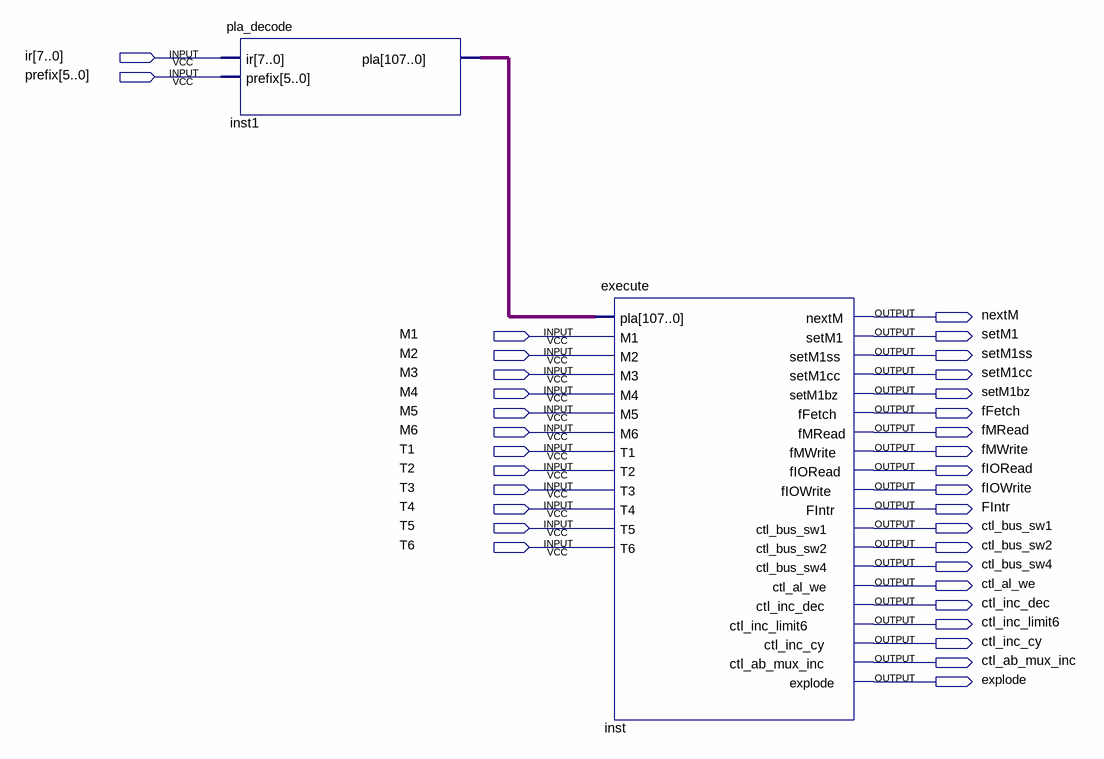
[diagram p0: schematic sheet]
// Quartus schematic test_control.bdf as structural Verilog: 2 symbols, 34 pins
module test_control (
  input  [7:0] ir,
  input  [5:0] prefix,
  input  M1,
  input  M2,
  input  M3,
  input  M4,
  input  M5,
  input  M6,
  input  T1,
  input  T2,
  input  T3,
  input  T4,
  input  T5,
  input  T6,
  output nextM,
  output setM1,
  output setM1ss,
  output setM1cc,
  output setM1bz,
  output fFetch,
  output fMRead,
  output fMWrite,
  output fIORead,
  output fIOWrite,
  output FIntr,
  output ctl_bus_sw1,
  output ctl_bus_sw2,
  output ctl_bus_sw4,
  output ctl_al_we,
  output ctl_inc_dec,
  output ctl_inc_limit6,
  output ctl_inc_cy,
  output ctl_ab_mux_inc,
  output explode
);

  wire [107:0] inst1_pla;

  pla_decode inst1 (.ir(ir), .prefix(prefix), .pla(inst1_pla));
  execute inst (
    .pla(inst1_pla), .M1(M1), .M2(M2), .M3(M3), .M4(M4), .M5(M5), .M6(M6), .T1(T1), .T2(T2), .T3(T3),
    .T4(T4), .T5(T5), .T6(T6), .nextM(nextM), .setM1(setM1), .setM1ss(setM1ss), .setM1cc(setM1cc),
    .setM1bz(setM1bz), .fFetch(fFetch), .fMRead(fMRead), .fMWrite(fMWrite), .fIORead(fIORead),
    .fIOWrite(fIOWrite), .FIntr(FIntr), .ctl_bus_sw1(ctl_bus_sw1), .ctl_bus_sw2(ctl_bus_sw2),
    .ctl_bus_sw4(ctl_bus_sw4), .ctl_al_we(ctl_al_we), .ctl_inc_dec(ctl_inc_dec),
    .ctl_inc_limit6(ctl_inc_limit6), .ctl_inc_cy(ctl_inc_cy), .ctl_ab_mux_inc(ctl_ab_mux_inc),
    .explode(explode));
endmodule
